# Altium project Jumperless_breadboard_REV1.PrjPcb (part 2 of 4)

## Sheet +-9V Supply.SchDoc
size 330 x 203 mm; SheetNumber: 12; SheetTotal: 14
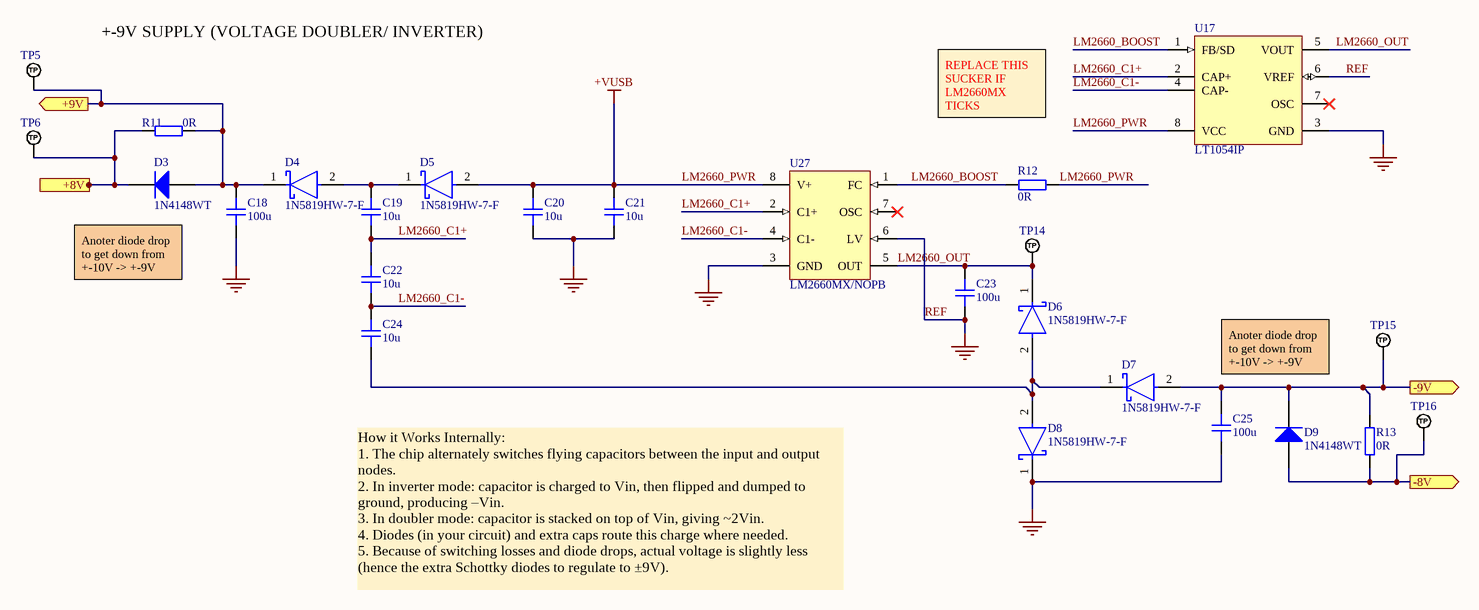
[diagram p9: +-9V Supply.SchDoc]

### Parts
C18  100u  [CAP_1210]
C19  10u  [CAP_1210]
C20  10u  [CAP_1210]
C21  10u  [CAP_1210]
C22  10u  [CAP_1210]
C23  100u  [CAP_1210]
C24  10u  [CAP_1210]
C25  100u  [CAP_1210]
D3  1N4148WT  [FAIR-SOD-523F-2_V]
D4  1N5819HW-7-F  [FP-SOD123-IPC_A]
D5  1N5819HW-7-F  [FP-SOD123-IPC_A]
D6  1N5819HW-7-F  [FP-SOD123-IPC_A]
D7  1N5819HW-7-F  [FP-SOD123-IPC_A]
D8  1N5819HW-7-F  [FP-SOD123-IPC_A]
D9  1N4148WT  [FAIR-SOD-523F-2_V]
R11  0R  [RES_0603]
R12  0R  [RES_0603]
R13  0R  [RES_0603]
TP5  TP_NOBOM  [PAD_RND_1MM]  (value not drawn)  (no BOM)
TP6  TP_NOBOM  [PAD_RND_1MM]  (value not drawn)  (no BOM)
TP14  TP_NOBOM  [PAD_RND_1MM]  (value not drawn)  (no BOM)
TP15  TP_NOBOM  [PAD_RND_1MM]  (value not drawn)  (no BOM)
TP16  TP_NOBOM  [PAD_RND_1MM]  (value not drawn)  (no BOM)
U17  LT1054IP  [P0008A]
U27  LM2660MX/NOPB  [D0008A_M]

### Ports
+8V (out), +9V (out), -8V (out), -9V (out)

### Nets
+8V: D3.1(K) R11.1 TP6.1(TP) ; port +8V
+VUSB: C20.2 C21.2 D5.2(A) R12.1 U17.8(VCC) U27.8(V+)  [also labelled LM2660_PWR]  [project net ANALOG_5V]
-8V: D9.2(A) R13.1 TP16.1(TP) ; port -8V
CH446_VDD: C18.2 D3.2(A) D4.1(C) R11.2 TP5.1(TP) ; port +9V
CH446_VEE: C25.2 D7.2(A) D9.1(K) R13.2 TP15.1(TP) ; port -9V
REF: C18.1 C20.1 C21.1 C23.1 C25.1 D8.1(C) U17.3(GND) U17.6(VREF) U27.3(GND) U27.6(LV)  [also labelled GND]
LM2660_BOOST: R12.2 U17.1(FB/SD) U27.1(FC)  [project net LM2660_BOOST_12]
LM2660_C1+: C19.1 C22.2 U17.2(CAP+) U27.2(C1+)  [project net LM2660_C1+_12]
LM2660_C1-: C22.1 C24.2 U17.4(CAP-) U27.4(C1-)  [project net LM2660_C1-_12]
LM2660_OUT: C23.2 D6.1(C) TP14.1(TP) U17.5(VOUT) U27.5(OUT)  [project net LM2660_OUT_12]
NetC19_2: C19.2 D4.2(A) D5.1(C)
NetC24_1: C24.1 D6.2(A) D7.1(C) D8.2(A)

Not connected (* = marked no-connect by the designer): U17 7(OSC)*; U27 7(OSC)*

### Notes on the sheet
- +-9V SUPPLY (VOLTAGE DOUBLER/ INVERTER)
- REPLACE THIS SUCKER IF LM2660MX TICKS
- Anoter diode drop to get down from +-10V -> +-9V
- How it Works Internally:
  1. The chip alternately switches flying capacitors between the input and output nodes.
  2. In inverter mode: capacitor is charged to Vin, then flipped and dumped to ground, producing –Vin.
  3. In doubler mode: capacitor is stacked on top of Vin, giving ~2Vin.
  4. Diodes (in your circuit) and extra caps route this charge where needed.
  5. Because of switching losses and diode drops, actual voltage is slightly less (hence the extra Schottky diodes to regulate to ±9V).

### Library data of the parts
C18-C25 = CAP_1210: Capacitor SMD 1210; Manufacturer: *; Manufacturer Part Number: *; Distributor Link: *; LCSC: *; Rating: *; Dielectric: *
D3 D9 = CMP-0881-00001-1: High Conductance Fast Switching Diode, 75 V, -55 to 150 degC, 2-Pin SOD523F, RoHS; Manufacturer: Fairchild Semiconductor; IR (VR: 75 V)=5 uA Max.; VF: 1 V Max.; BVR (IR: 5 uA)=75 V Min.; CO: 4 pF Max.; DatasheetVersion: Rev. A2; ComponentLink1Description: Manufacturer URL; PackageDescription: 2-Pin Surface Mount Device, Body 1.2 x 0.8 mm, Height 0.7 mm; ComponentLink2URL: http://www.fairchildsemi.com/ds/1N/1N4148WT.pdf; ComponentLink2Description: Datasheet; PartNumber: 1N4148WT; ComponentLink1URL: http://www.fairchildsemi.com/; Temperature Range: -55 to 150 degC; Mounting Technology: Surface Mount; PackageReference: SOD-523F-2; RoHS: TRUE
D4-D8 = CMP-0303-00003-3: DIODE SCHOTTKY 40V 1A SOD123; Forward Voltage: 450mV; Capacitance: 110pF; Max Forward Surge Current (Ifsm): 25A; Peak Reverse Current: 50uA; Polarity: Standard; Element Configuration: Single; Max Power Dissipation: 450mW; Min Operating Temperature: -65°C; Package Quantity: 3000; Contact Plating: Tin; Weight: 0.000353oz; Max Repetitive Reverse Voltage (Vrrm): 40V; Max Reverse Voltage (DC): 40V; Height: 1.25mm; Average Rectified Current: 1A; Width: 1.7mm; Case/Package: SOD-123-2; Lead Free: Lead Free; Max Operating Temperature: 125°C; Current Rating: 1A; Termination: SMD/SMT; Forward Current: 1A; Radiation Hardening: No; Number of Pins: 2; Length: 2.85mm; Voltage Rating (DC): 40V; REACH SVHC: No SVHC; Peak Non-Repetitive Surge Current: 25A; Packaging: Tape and Reel; Output Current: 1A
R11-R13 = RES_0603: Resistor SMD 0603; Manufacturer: *; Manufacturer Part Number: *; Distributor Link: *; LCSC: *
TP5 TP6 TP14-TP16 = TEST_POINT_RND_1MM: Test Point Round 1mm (NO BOM)
U17 = CMP-0391-00173-2: -5 V, Buck / Boost Charge Pump, 100 mA, 3.5 to 15 V Input, -40 to 85 degC, 8-pin DIP (P8), Pb-Free (RoHS); Manufacturer: Texas Instruments; Vin(Min)(V): 3.5; Vout(Max)(V): -5.2; Iout(Max)(A): 0.1; Iq(Typ)(mA): 2.5; Switching Frequency(Max)(kHz): 35; Vout(Min)(V): -4.7; Vin(Max)(V): 15; ComponentLink3URL: http://www.ti.com/litv/pdf/mpdi001b; Eco-Plan: Pb-Free (RoHS); PackageVersion: 4040082/E; DatasheetVersion: SLVS033F; Mounting Technology: Through Hole; ComponentLink1Description: Manufacturer URL; Preset Vout(V): -5; Topology: Buck/Boost; ComponentLink1URL: http://www.ti.com/; ComponentLink2Description: Datasheet; ComponentLink3Description: Package Specification; PartNumber: LT1054IP; PackageDescription: 8-Pin Plastic In-Line, Body 9.59 x 6.35 mm, 2.54 mm Pitch; ComponentLink2URL: http://www.ti.com/general/docs/lit/getliterature.tsp?genericPartNumber=LT1054&fileType=pdf; PackageReference: P0008A; Code_JEDEC: MS-001
U27 = CMP-0065-00023-3: Switched Capacitor Voltage Converter, 8-pin Narrow SOIC, Pb-Free; Manufacturer: Texas Instruments; CompType: Switch Caps; PowerWise: N; PackageTopMarking: NSZXTT*LM26*60M; PackageReference: D0008A; ComponentLink1Description: Datasheet URL; PinCount: 8; PackageDescription: SOIC Narrow, 4.9 x 3.9 x 1.45mm, 8 Lead, 1.27mm Pitch; RoHS: Y; Code_IPC: SOIC127P600-8; Code_JEDEC: MS-012-AA; ComponentLink1URL: http://www.ti.com/general/docs/lit/getliterature.tsp?genericPartNumber=LM2660&fileType=pdf

## Sheet BreadBoard.SchDoc
size 190 x 203 mm; SheetNumber: 7; SheetTotal: 15
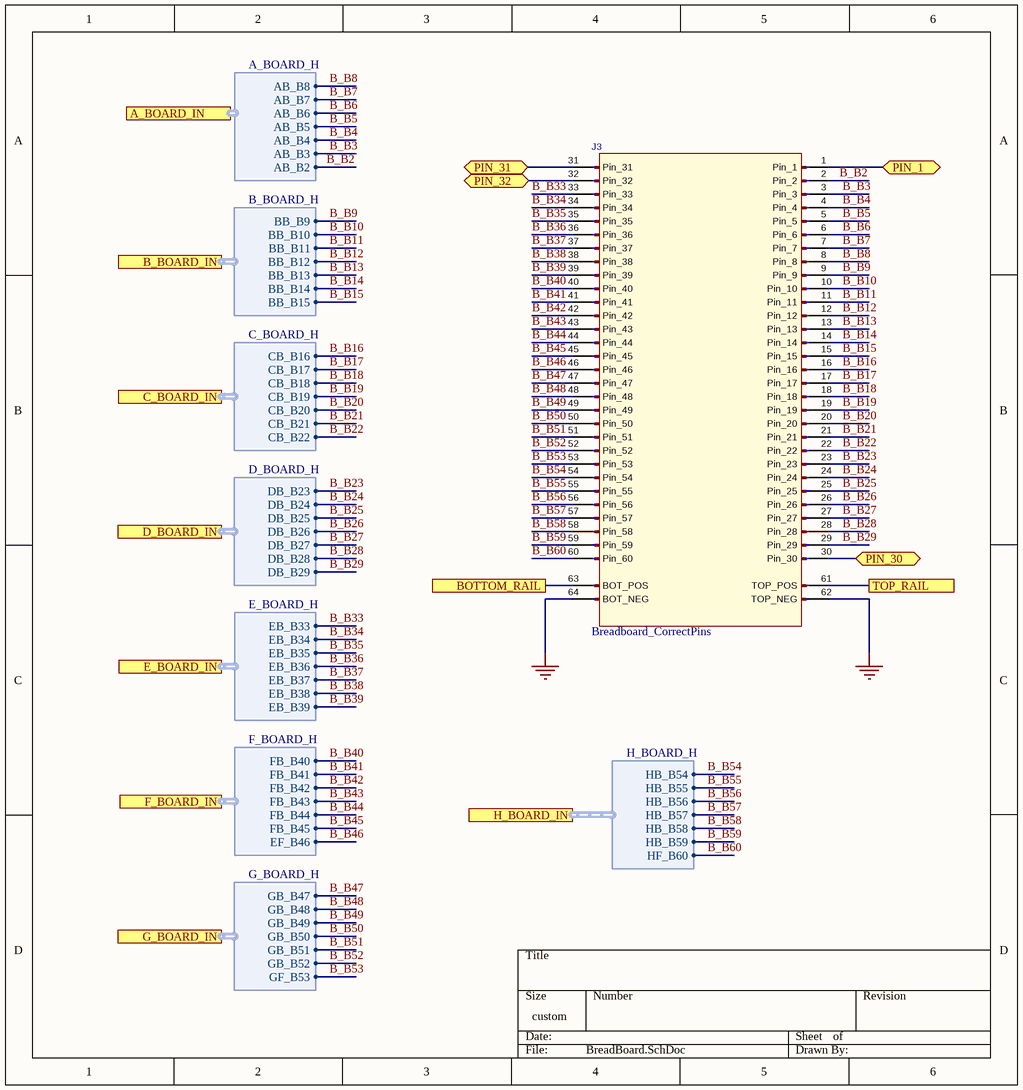
[diagram p10: BreadBoard.SchDoc]

### Parts
J3  Breadboard_CorrectPins  [Breadboard_CustomClips_CorrectPins_1]

### Ports
A_BOARD_IN (harness A_BOARD_H), B_BOARD_IN (harness B_BOARD_H), BOTTOM_RAIL, C_BOARD_IN (harness C_BOARD_H), D_BOARD_IN (harness D_BOARD_H), E_BOARD_IN (harness E_BOARD_H), F_BOARD_IN (harness F_BOARD_H), G_BOARD_IN (harness G_BOARD_H), H_BOARD_IN (harness H_BOARD_H), PIN_1 (bidir), PIN_30 (bidir), PIN_31 (bidir), PIN_32 (bidir), TOP_RAIL

### Harnesses
A_BOARD_H: AB_B2, AB_B3, AB_B4, AB_B5, AB_B6, AB_B7, AB_B8
B_BOARD_H: BB_B10, BB_B11, BB_B12, BB_B13, BB_B14, BB_B15, BB_B9
C_BOARD_H: CB_B16, CB_B17, CB_B18, CB_B19, CB_B20, CB_B21, CB_B22
D_BOARD_H: DB_B23, DB_B24, DB_B25, DB_B26, DB_B27, DB_B28, DB_B29
E_BOARD_H: EB_B33, EB_B34, EB_B35, EB_B36, EB_B37, EB_B38, EB_B39
F_BOARD_H: EF_B46, FB_B40, FB_B41, FB_B42, FB_B43, FB_B44, FB_B45
G_BOARD_H: GB_B47, GB_B48, GB_B49, GB_B50, GB_B51, GB_B52, GF_B53
H_BOARD_H: HB_B54, HB_B55, HB_B56, HB_B57, HB_B58, HB_B59, HF_B60

### Nets
GND: J3.62(TOP_NEG) J3.64(BOT_NEG)  [project net REF]
B_B2: J3.2(Pin_2) ; port A_BOARD_IN.AB_B2
B_B3: J3.3(Pin_3) ; port A_BOARD_IN.AB_B3
B_B4: J3.4(Pin_4) ; port A_BOARD_IN.AB_B4
B_B5: J3.5(Pin_5) ; port A_BOARD_IN.AB_B5
B_B6: J3.6(Pin_6) ; port A_BOARD_IN.AB_B6
B_B7: J3.7(Pin_7) ; port A_BOARD_IN.AB_B7
B_B8: J3.8(Pin_8) ; port A_BOARD_IN.AB_B8
B_B9: J3.9(Pin_9) ; port B_BOARD_IN.BB_B9
B_B10: J3.10(Pin_10) ; port B_BOARD_IN.BB_B10
B_B11: J3.11(Pin_11) ; port B_BOARD_IN.BB_B11
B_B12: J3.12(Pin_12) ; port B_BOARD_IN.BB_B12
B_B13: J3.13(Pin_13) ; port B_BOARD_IN.BB_B13
B_B14: J3.14(Pin_14) ; port B_BOARD_IN.BB_B14
B_B15: J3.15(Pin_15) ; port B_BOARD_IN.BB_B15
B_B16: J3.16(Pin_16) ; port C_BOARD_IN.CB_B16
B_B17: J3.17(Pin_17) ; port C_BOARD_IN.CB_B17
B_B18: J3.18(Pin_18) ; port C_BOARD_IN.CB_B18
B_B19: J3.19(Pin_19) ; port C_BOARD_IN.CB_B19
B_B20: J3.20(Pin_20) ; port C_BOARD_IN.CB_B20
B_B21: J3.21(Pin_21) ; port C_BOARD_IN.CB_B21
B_B22: J3.22(Pin_22) ; port C_BOARD_IN.CB_B22
B_B23: J3.23(Pin_23) ; port D_BOARD_IN.DB_B23
B_B24: J3.24(Pin_24) ; port D_BOARD_IN.DB_B24
B_B25: J3.25(Pin_25) ; port D_BOARD_IN.DB_B25
B_B26: J3.26(Pin_26) ; port D_BOARD_IN.DB_B26
B_B27: J3.27(Pin_27) ; port D_BOARD_IN.DB_B27
B_B28: J3.28(Pin_28) ; port D_BOARD_IN.DB_B28
B_B29: J3.29(Pin_29) ; port D_BOARD_IN.DB_B29
B_B33: J3.33(Pin_33) ; port E_BOARD_IN.EB_B33
B_B34: J3.34(Pin_34) ; port E_BOARD_IN.EB_B34
B_B35: J3.35(Pin_35) ; port E_BOARD_IN.EB_B35
B_B36: J3.36(Pin_36) ; port E_BOARD_IN.EB_B36
B_B37: J3.37(Pin_37) ; port E_BOARD_IN.EB_B37
B_B38: J3.38(Pin_38) ; port E_BOARD_IN.EB_B38
B_B39: J3.39(Pin_39) ; port E_BOARD_IN.EB_B39
B_B40: J3.40(Pin_40) ; port F_BOARD_IN.FB_B40
B_B41: J3.41(Pin_41) ; port F_BOARD_IN.FB_B41
B_B42: J3.42(Pin_42) ; port F_BOARD_IN.FB_B42
B_B43: J3.43(Pin_43) ; port F_BOARD_IN.FB_B43
B_B44: J3.44(Pin_44) ; port F_BOARD_IN.FB_B44
B_B45: J3.45(Pin_45) ; port F_BOARD_IN.FB_B45
B_B46: J3.46(Pin_46) ; port F_BOARD_IN.EF_B46
B_B47: J3.47(Pin_47) ; port G_BOARD_IN.GB_B47
B_B48: J3.48(Pin_48) ; port G_BOARD_IN.GB_B48
B_B49: J3.49(Pin_49) ; port G_BOARD_IN.GB_B49
B_B50: J3.50(Pin_50) ; port G_BOARD_IN.GB_B50
B_B51: J3.51(Pin_51) ; port G_BOARD_IN.GB_B51
B_B52: J3.52(Pin_52) ; port G_BOARD_IN.GB_B52
B_B53: J3.53(Pin_53) ; port G_BOARD_IN.GF_B53
B_B54: J3.54(Pin_54) ; port H_BOARD_IN.HB_B54
B_B55: J3.55(Pin_55) ; port H_BOARD_IN.HB_B55
B_B56: J3.56(Pin_56) ; port H_BOARD_IN.HB_B56
B_B57: J3.57(Pin_57) ; port H_BOARD_IN.HB_B57
B_B58: J3.58(Pin_58) ; port H_BOARD_IN.HB_B58
B_B59: J3.59(Pin_59) ; port H_BOARD_IN.HB_B59
B_B60: J3.60(Pin_60) ; port H_BOARD_IN.HF_B60
BB_1: J3.1(Pin_1) ; port PIN_1
BB_30: J3.30(Pin_30) ; port PIN_30
BB_31: J3.31(Pin_31) ; port PIN_31
BB_32: J3.32(Pin_32) ; port PIN_32
BB_BOTTOM_RAIL: J3.63(BOT_POS) ; port BOTTOM_RAIL
BB_TOP_RAIL: J3.61(TOP_POS) ; port TOP_RAIL

## Sheet ANALOG_CIRCUITS.SchDoc
size 482 x 304 mm; SheetNumber: 9; SheetTotal: 14
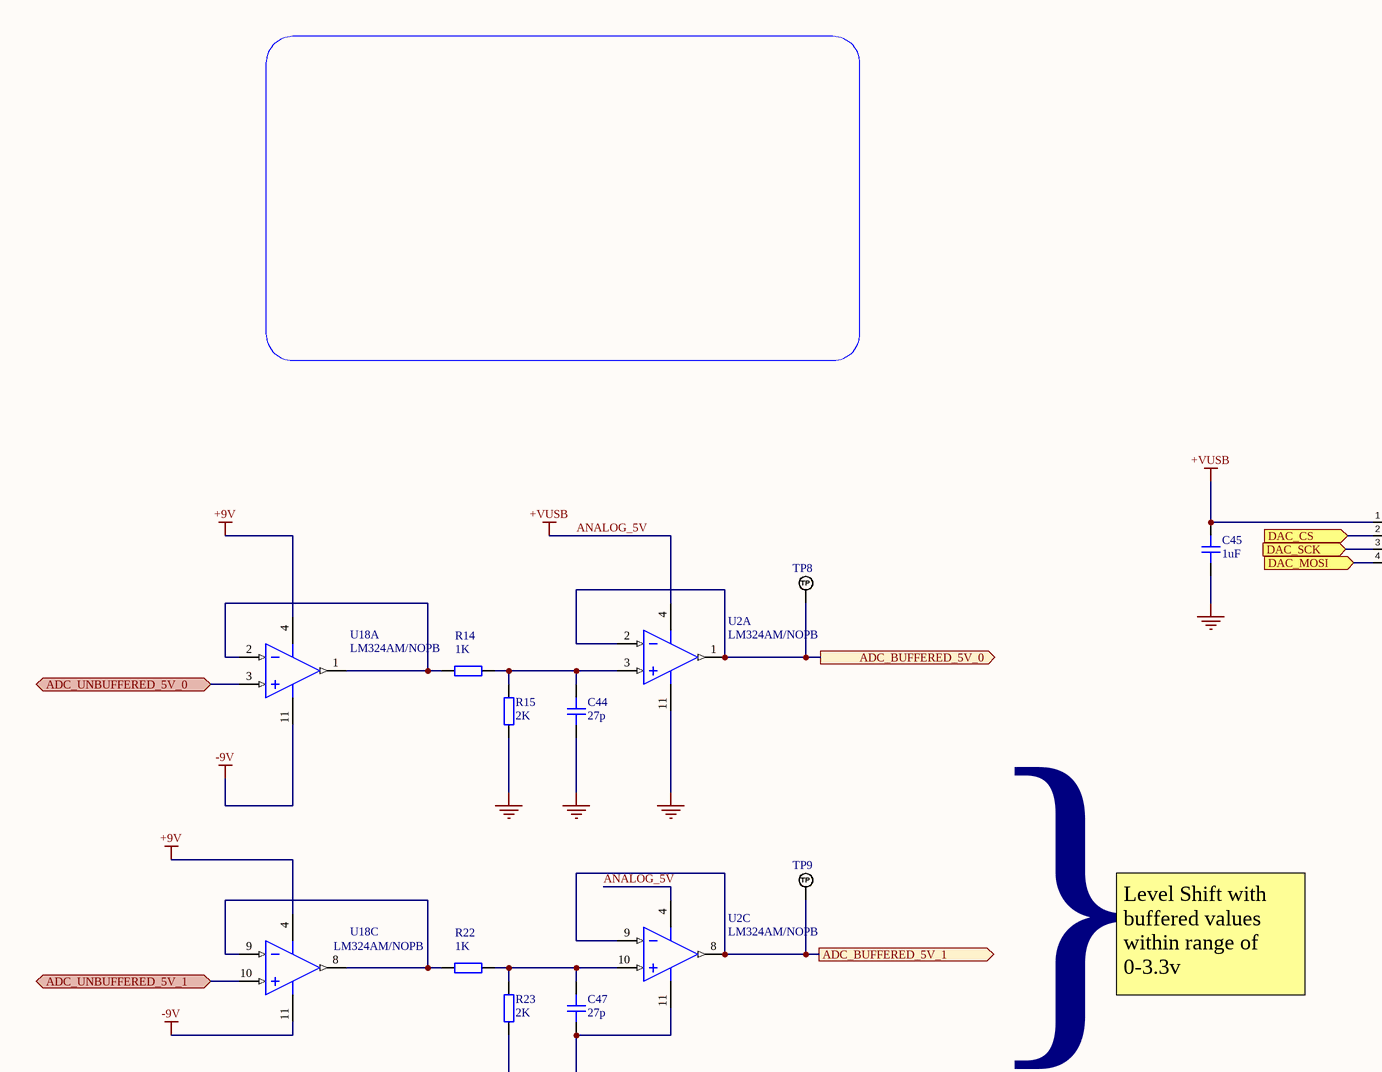
[diagram p11: ANALOG_CIRCUITS.SchDoc, top left]
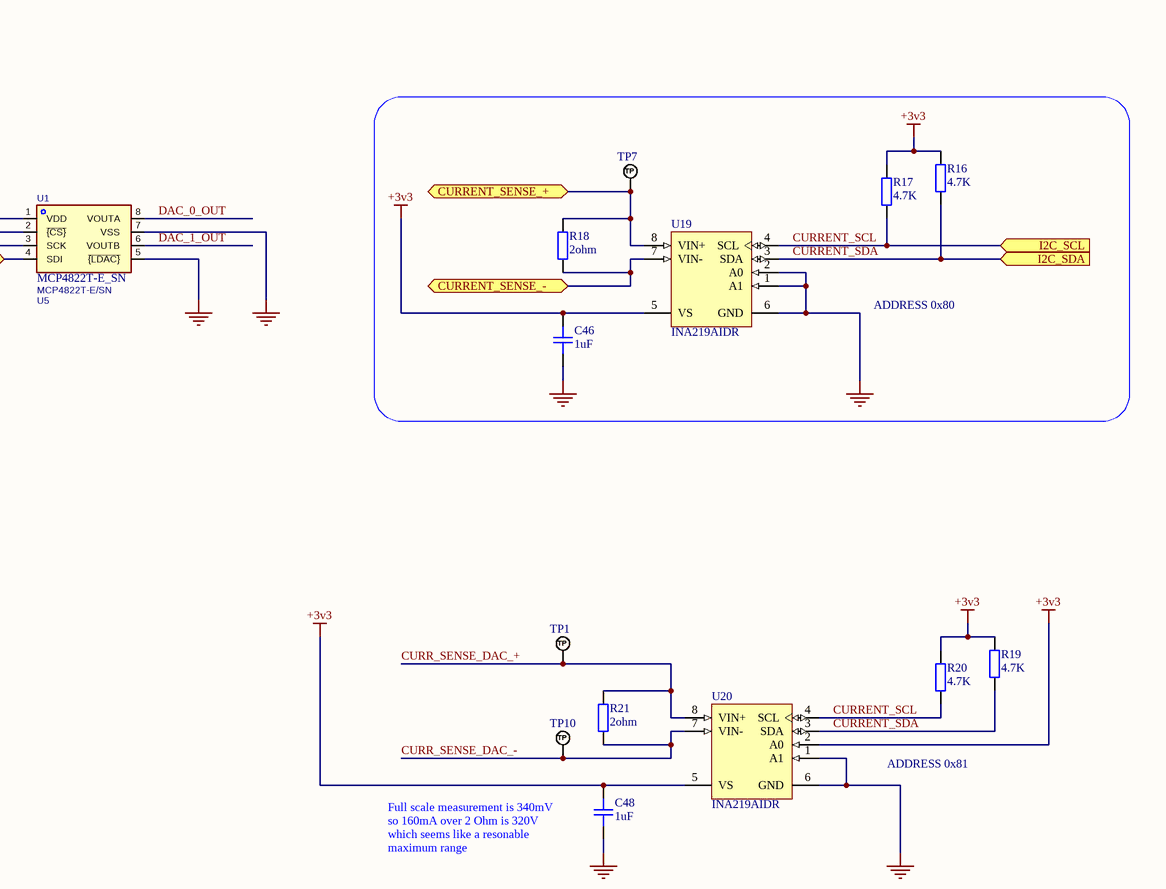
[diagram p12: ANALOG_CIRCUITS.SchDoc, top right]
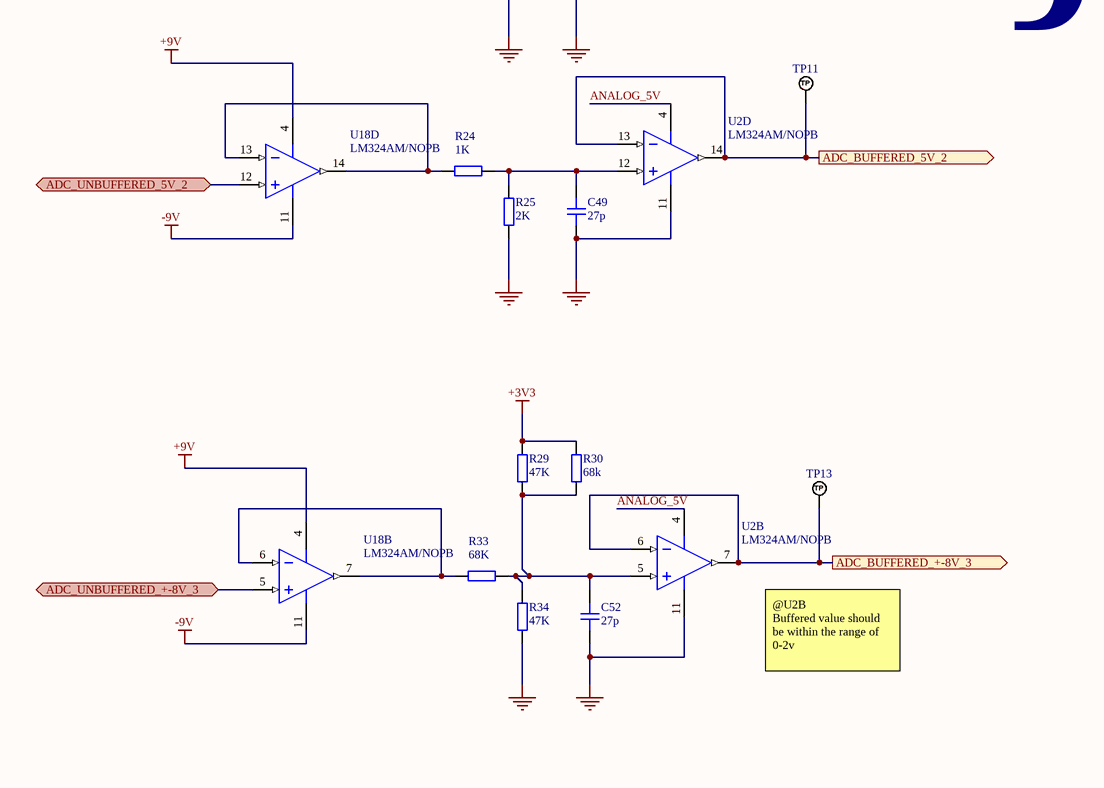
[diagram p13: ANALOG_CIRCUITS.SchDoc, bottom left]
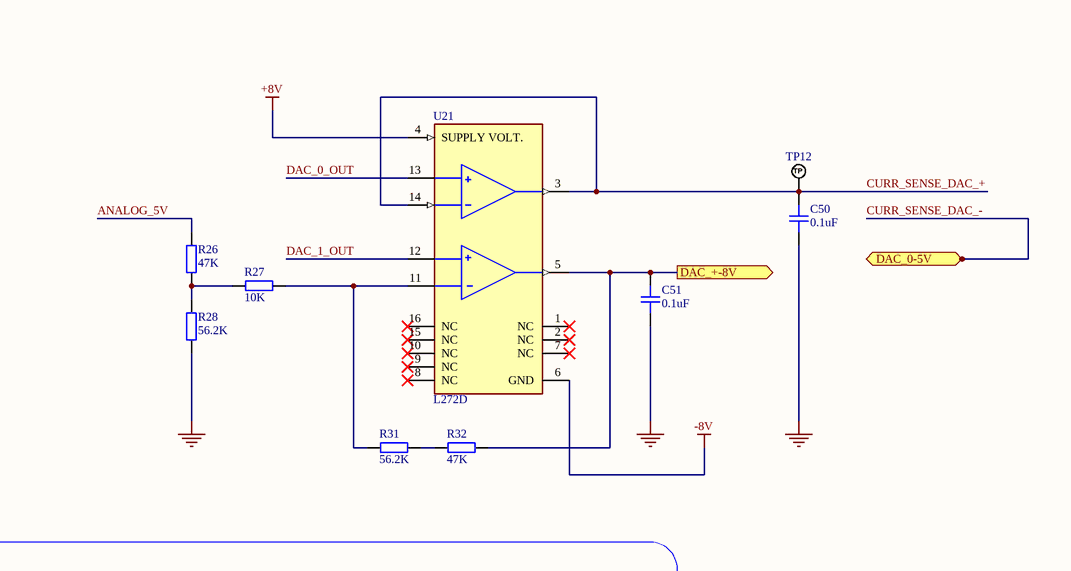
[diagram p14: ANALOG_CIRCUITS.SchDoc, bottom right]

### Parts
C44  27p  [CAP_0603]
C45  1uF  [CAP_0603]
C46  1uF  [CAP_0603]
C47  27p  [CAP_0603]
C48  1uF  [CAP_0603]
C49  27p  [CAP_0603]
C50  0.1uF  [CAP_0603]
C51  0.1uF  [CAP_0603]
C52  27p  [CAP_0603]
R14  1K  [RES_0603]
R15  2K  [RES_0603]
R16  4.7K  [RES_0603]
R17  4.7K  [RES_0603]
R18  2ohm  [RES_0603]
R19  4.7K  [RES_0603]
R20  4.7K  [RES_0603]
R21  2ohm  [RES_0603]
R22  1K  [RES_0603]
R23  2K  [RES_0603]
R24  1K  [RES_0603]
R25  2K  [RES_0603]
R26  47K  [RES_0603]
R27  10K  [RES_0603]
R28  56.2K  [RES_0603]
R29  47K  [RES_0603]
R30  68k  [RES_0603]
R31  56.2K  [RES_0603]
R32  47K  [RES_0603]
R33  68K  [RES_0603]
R34  47K  [RES_0603]
TP1  TP_NOBOM  [PAD_RND_1MM]  (value not drawn)  (no BOM)
TP7  TP_NOBOM  [PAD_RND_1MM]  (value not drawn)  (no BOM)
TP8  TP_NOBOM  [PAD_RND_1MM]  (value not drawn)  (no BOM)
TP9  TP_NOBOM  [PAD_RND_1MM]  (value not drawn)  (no BOM)
TP10  TP_NOBOM  [PAD_RND_1MM]  (value not drawn)  (no BOM)
TP11  TP_NOBOM  [PAD_RND_1MM]  (value not drawn)  (no BOM)
TP12  TP_NOBOM  [PAD_RND_1MM]  (value not drawn)  (no BOM)
TP13  TP_NOBOM  [PAD_RND_1MM]  (value not drawn)  (no BOM)
U1  MCP4822T-E_SN  value MCP4822T-E/SN  Reference: U5  [SOIC-8_L4.9-W3.9-P1.27-LS6.0-BL]
U2  LM324AM/NOPB  [D0014A_M]  (parts A,B,C,D of 4)
U18  LM324AM/NOPB  [D0014A_M]  (parts A,B,C,D of 4)
U19  INA219AIDR  [D0008A_L]
U20  INA219AIDR  [D0008A_L]
U21  L272D  [FP-SO16_Narrow-0016020-IPC_C]

### Blocks framed on the sheet
ADDRESS 0x80: C46 R16-R18 TP7 U19

### Ports
ADC_BUFFERED_5V_0 (out), ADC_BUFFERED_5V_1 (out), ADC_BUFFERED_5V_2 (out), ADC_BUFFERED_+-8V_3 (out), ADC_UNBUFFERED_5V_0 (bidir), ADC_UNBUFFERED_5V_1 (bidir), ADC_UNBUFFERED_5V_2 (bidir), ADC_UNBUFFERED_+-8V_3 (bidir), CURRENT_SENSE_+ (bidir), CURRENT_SENSE_- (bidir), DAC_0-5V (bidir), DAC_+-8V (out), DAC_CS (in), DAC_MOSI (in), DAC_SCK (in), I2C_SCL (in), I2C_SDA (in)

### Nets
+3V3: C46.2 C48.2 R16.2 R17.2 R19.2 R20.2 R29.2 R30.2 U19.5(VS) U20.2(A0) U20.5(VS)  [project net BUCK1_3v3]
+8V: U21.4(SUPPLY_VOLT.)
+9V: U18.4(V+)  [project net CH446_VDD]
-8V: U21.6(GND)
-9V: U18.11(GND)  [project net CH446_VEE]
ANALOG_5V: C45.2 R26.2 U1.1(VDD) U2.4(V+)  [also labelled +VUSB]
GND: C44.1 C45.1 C46.1 C47.1 C48.1 C49.1 C50.1 C51.1 C52.1 R15.1 R23.1 R25.1 R28.1 R34.1 U1.5(~{{LDAC}}) U1.7(VSS) U2.11(GND) U19.1(A1) U19.2(A0) U19.6(GND) U20.1(A1) U20.6(GND)  [project net REF]
ADC_BUFF_5V_0: TP8.1(TP) U2.1(OUT1) U2.2(IN1-) ; port ADC_BUFFERED_5V_0
ADC_BUFF_5V_1: TP9.1(TP) U2.8(OUT3) U2.9(IN3-) ; port ADC_BUFFERED_5V_1
ADC_BUFF_5V_2: TP11.1(TP) U2.13(IN4-) U2.14(OUT4) ; port ADC_BUFFERED_5V_2
ADC_BUFF_+-8V: TP13.1(TP) U2.6(IN2-) U2.7(OUT2) ; port ADC_BUFFERED_+-8V_3
CURR_SENSE_DAC_+: C50.2 R21.2 TP1.1(TP) TP12.1(TP) U20.8(VIN+) U21.3(OUTPUT_1) U21.14(INPUT-_1)  [project net CURR_SENSE_DAC_+_9]
CURRENT_SCL: R17.1 R20.1 U19.4(SCL) U20.4(SCL) ; port I2C_SCL
CURRENT_SDA: R16.1 R19.1 U19.3(SDA) U20.3(SDA) ; port I2C_SDA
DAC-SS: U1.2(~{{CS}}) ; port DAC_CS
DAC_0_OUT: U1.8(VOUTA) U21.13(INPUT+_1)  [project net DAC_0_OUT_9]
DAC_1_OUT: U1.6(VOUTB) U21.12(INPUT+_2)  [project net DAC_1_OUT_9]
DAC_CLOCK: U1.3(SCK) ; port DAC_SCK
DAC_DATA: U1.4(SDI) ; port DAC_MOSI
NetC44_2: C44.2 R14.2 R15.2 U2.3(IN1+)
NetC47_2: C47.2 R22.2 R23.2 U2.10(IN3+)
NetC49_2: C49.2 R24.2 R25.2 U2.12(IN4+)
NetC51_2: C51.2 R32.1 U21.5(OUTPUT_2) ; port DAC_+-8V
NetC52_2: C52.2 R29.1 R30.1 R33.2 R34.2 U2.5(IN2+)
NetR14_1: R14.1 U18.1(OUT1) U18.2(IN1-)
NetR18_1: R18.1 U19.7(VIN-) ; port CURRENT_SENSE_-
NetR18_2: R18.2 TP7.1(TP) U19.8(VIN+) ; port CURRENT_SENSE_+
NetR21_1: R21.1 TP10.1(TP) U20.7(VIN-)
NetR22_1: R22.1 U18.8(OUT3) U18.9(IN3-)
NetR24_1: R24.1 U18.13(IN4-) U18.14(OUT4)
NetR26_1: R26.1 R27.2 R28.2
NetR27_1: R27.1 R31.2 U21.11(INPUT-_2)
NetR31_1: R31.1 R32.2
NetR33_1: R33.1 U18.6(IN2-) U18.7(OUT2)
NetU18_3: U18.3(IN1+) ; port ADC_UNBUFFERED_5V_0
NetU18_5: U18.5(IN2+) ; port ADC_UNBUFFERED_+-8V_3
NetU18_10: U18.10(IN3+) ; port ADC_UNBUFFERED_5V_1
NetU18_12: U18.12(IN4+) ; port ADC_UNBUFFERED_5V_2

Not connected (* = marked no-connect by the designer): U21 1(NC)* 2(NC)* 7(NC)* 8(NC)* 9(NC)* 10(NC)* 15(NC)* 16(NC)*

### Notes on the sheet
- Level Shift with buffered values within range of 0-3.3v
- ADDRESS 0x81
- }
- Full scale measurement is 340mV
  so 160mA over 2 Ohm is 320V
  which seems like a resonable maximum range
- @U2B
  Buffered value should be within the range of 0-2v

### Library data of the parts
C44-C52 = CAP_0603: Capacitor SMD 0603; Manufacturer: *; Manufacturer Part Number: *; Distributor Link: *; LCSC: *; Rating: *; Dielectric: *
R14-R34 = RES_0603: Resistor SMD 0603; Manufacturer: *; Manufacturer Part Number: *; Distributor Link: *; LCSC: *
TP1 TP7-TP13 = TEST_POINT_RND_1MM: Test Point Round 1mm (NO BOM)
U2 U18 = CMP-0055-00733-3: Low Power Quad Operational Amplifier, 14-pin Narrow SOIC, Pb-Free; Manufacturer: Texas Instruments; PowerWise: N; PackageTopMarking: NSUZXYTTE#*LM324AM; CompType: Amplifiers; RoHS: Y; Code_IPC: SOIC127P600-14; ComponentLink1Description: Datasheet URL; PackageDescription: Molded Package S.O., .150in Wide, 14 Lead; PinCount: 14; Package Reference: D0014A; ComponentLink1URL: http://www.ti.com/general/docs/lit/getliterature.tsp?genericPartNumber=LM324-N&fileType=pdf; Code_JEDEC: MS-012AB
U19 U20 = CMP-0704-00003-2: Zero-Drift, Bi-Directional Current / Power Monitor, 3 to 5.5 V, -40 to 125 degC, 8-pin SOIC (D8), Green (RoHS & no Sb/Br); Manufacturer: Texas Instruments; Common Mode Range(Min)(V): 0; SubFamily: Current Shunt Monitor; Rating: Catalog; Input Offset (+/-)(Max)(uV): 100; Vs(Max)(V): 5.5; Common Mode Range(Max)(V): 26; Quiescent Current (+/-)(Typ)(mA): 0.7; Vs(Min)(V): 3; Gain(V/V): 1, 0.5, 0.25, 0.125; Small-Signal Bandwidth(Typ)(MHz): 0.011; PackageReference: D0008A; ComponentLink1URL: http://www.ti.com/; Eco-Plan: Green (RoHS & no Sb/Br); ComponentLink2URL: http://www.ti.com/general/docs/lit/getliterature.tsp?genericPartNumber=INA219&fileType=pdf; ComponentLink1Description: Manufacturer URL; ComponentLink3Description: Package Specification; Mounting Technology: Surface Mount; PackageDescription: 8-Pin Plastic Small Outline, Body 4.9 x 3.9 mm, Pitch 1.27 mm; ComponentLink3URL: http://www.ti.com/lit/ml/msoi002j/msoi002j.pdf; DatasheetVersion: SBOS448F; PackageVersion: 4040047-3/M, 06/2011; PartNumber: INA219AIDR; Code_JEDEC: MS-012; ComponentLink2Description: Datasheet; CMRR(Min)(dB): 100
U21 = CMP-12131-000001-1: IC OPAMP GP 2 CIRCUIT 16SO; Manufacturer: STMicroelectronics; Min Dual Supply Voltage: 2V; Number Of Channels: 2; Max Supply Voltage: 28V; Max Dual Supply Voltage: 14V; Voltage Gain: 50-70dB; Max Junction Temp: +150°C; Standoff Height: 0.1mm; Nominal Supply Current: 7.5-8mA; Gain Bandwidth: 350kHz; Input Bias Current: 0.3uA; Output Current Per Channel: 1A; Input Offset Voltage: 15mV; Min Supply Voltage: 4V; Ipc Land Pattern Name: SOIC127P600X175-16; Height: 1.75mm; ComponentLink2URL: https://www.st.com/resource/en/datasheet/l272.pdf; Device Class L3: Amplifiers - Op Amps; RoHS: TRUE; Package: SO16 Narrow-0016020; Octopart: https://octopart.com/l272d-stmicroelectronics-410409; ComponentLink2Description: Datasheet; Automotive: No; Category: IC; Device Class L1: Integrated Circuits (ICs); Temperature Range High: +85°C; Temperature Range Low: -40°C; Mouser Description: Operational Amplifier, Dual, 250 Khz, 2, 1 V/ S, 4V To 28V, Soic, 16 Rohs Compliant: Yes; Digikey Description: IC OPAMP GP 2 CIRCUIT 16SO; Device Class L2: Linear ICs; Temperature: -40°C to +85°C; Manufacturer Part Number: L272D; Lead Free: Yes
U1 = MCP4822T-E_SN: Footprint: easyeda2kicad:SOIC-8_L4.9-W3.9-P1.27-LS6.0-BL; LCSC Part: C623653

## Sheet CONTROL_ROUTING_CROSSPOINTS.SchDoc
size 381 x 304 mm; SheetNumber: 4; SheetTotal: 14
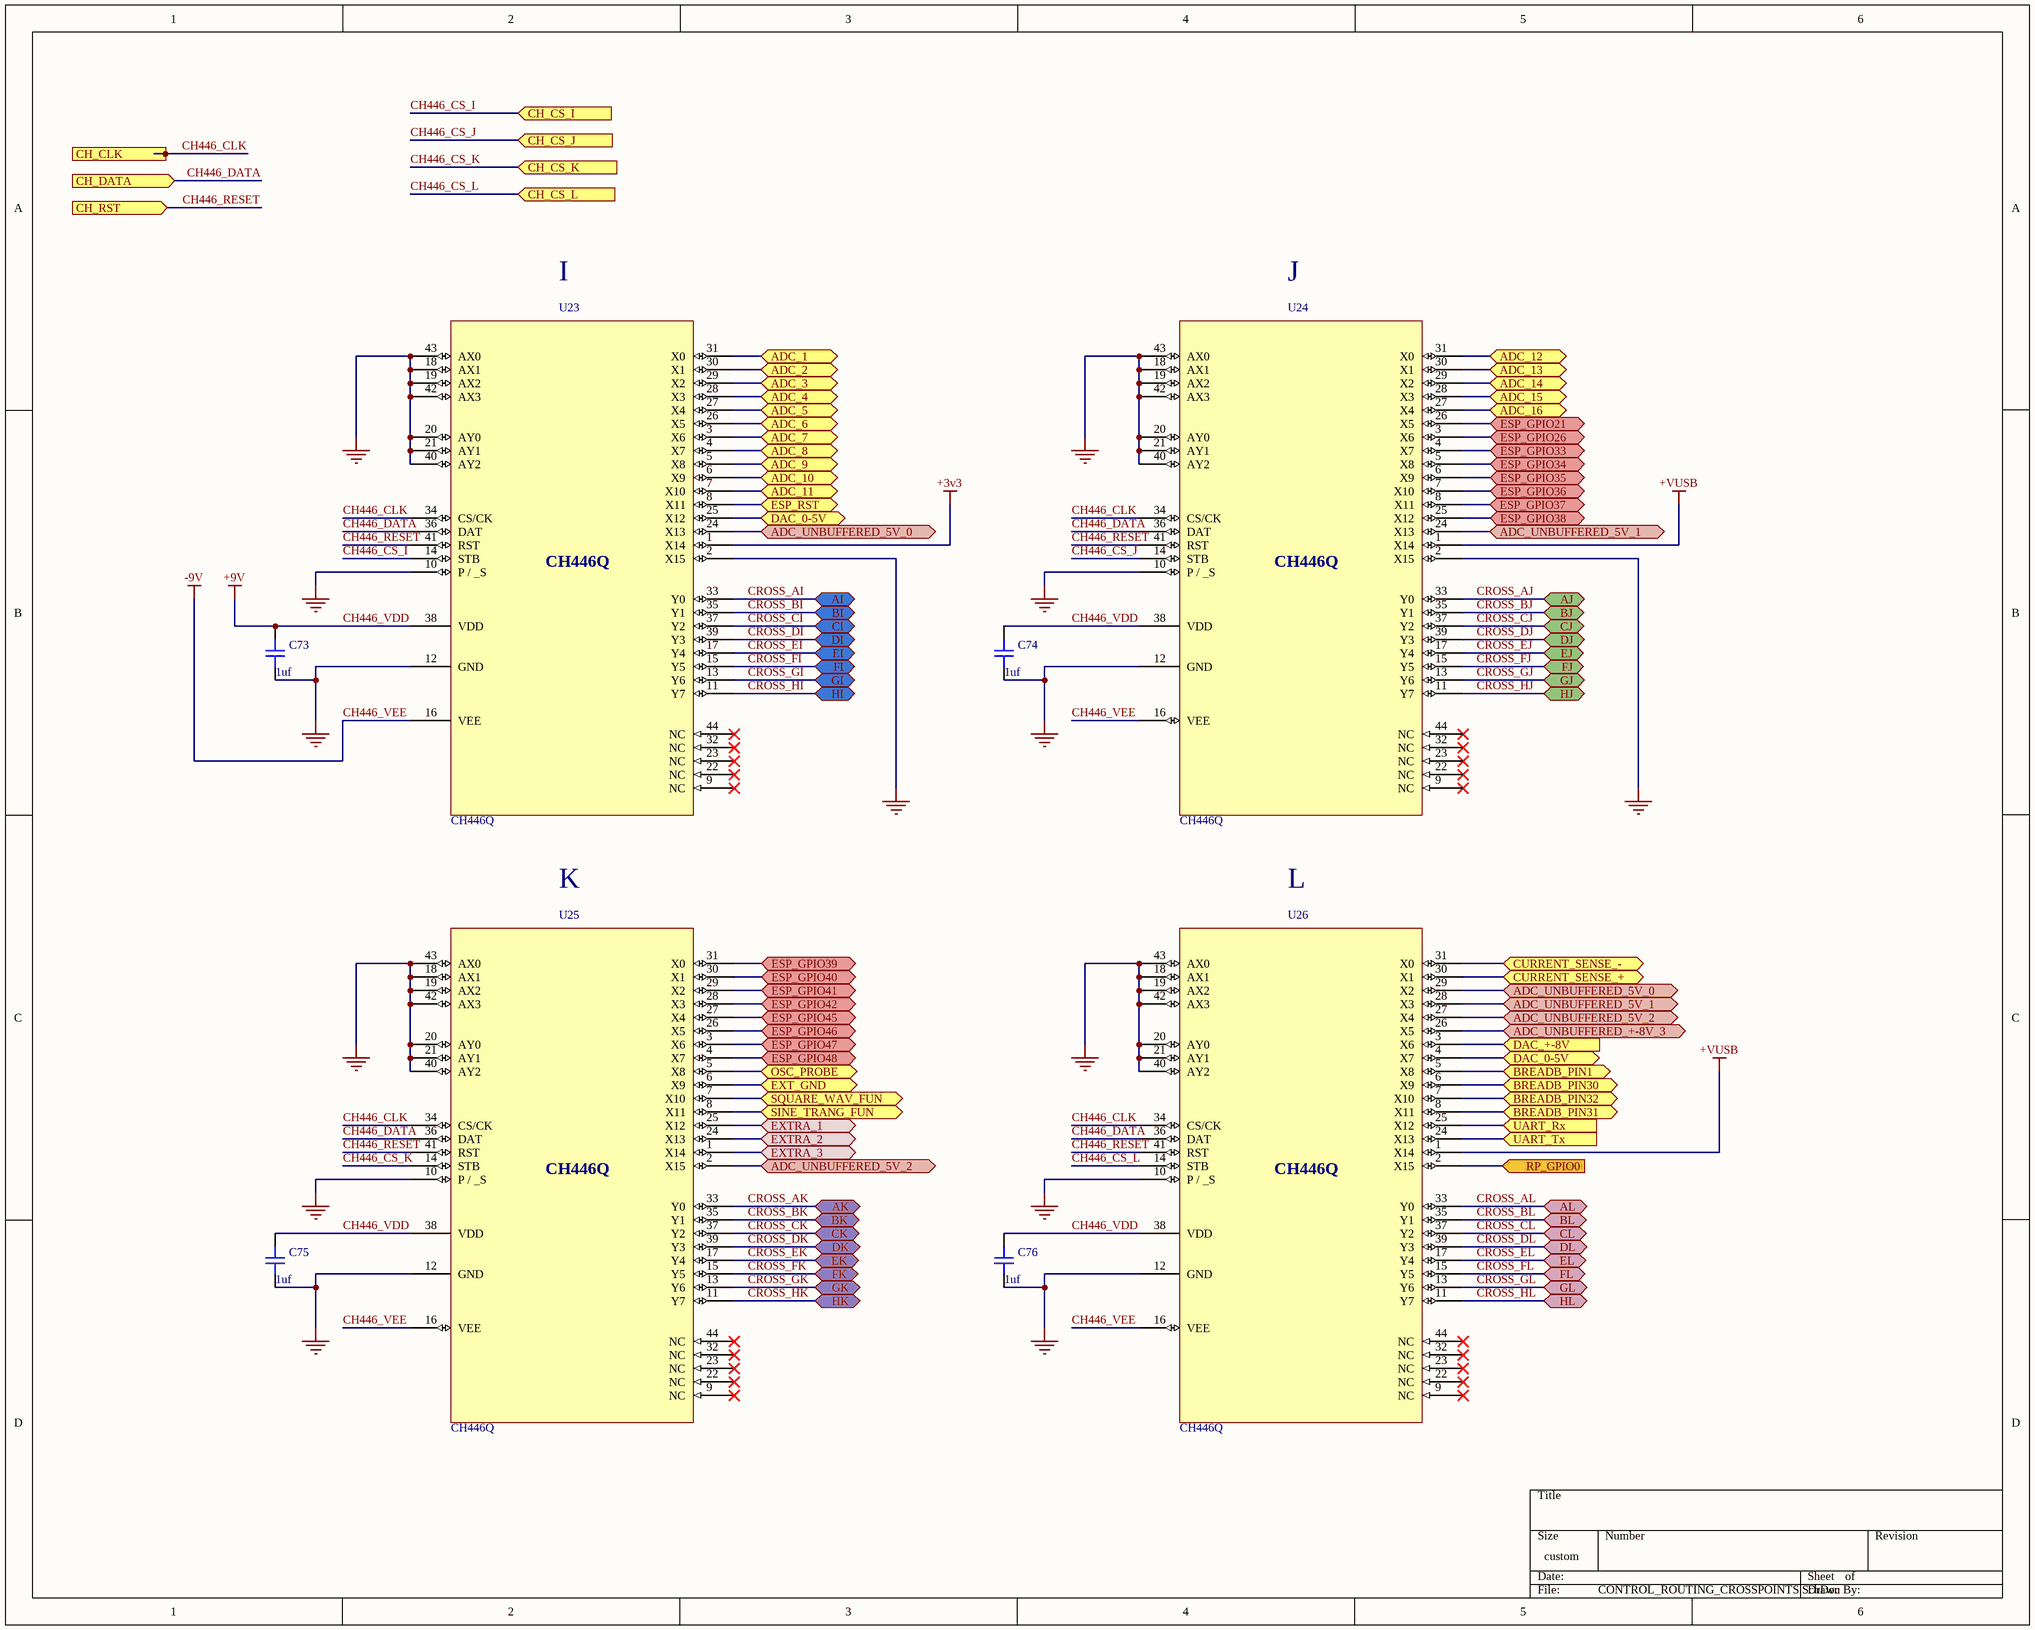
[diagram p15: CONTROL_ROUTING_CROSSPOINTS.SchDoc]

### Parts
C73  1uf  [CAP_0603]
C74  1uf  [CAP_0603]
C75  1uf  [CAP_0603]
C76  1uf  [CAP_0603]
U23  CH446Q  [PG-LQFP-44]
U24  CH446Q  [PG-LQFP-44]
U25  CH446Q  [PG-LQFP-44]
U26  CH446Q  [PG-LQFP-44]

### Ports
ADC_1 (bidir), ADC_2 (bidir), ADC_3 (bidir), ADC_4 (bidir), ADC_5 (bidir), ADC_6 (bidir), ADC_7 (bidir), ADC_8 (bidir), ADC_9 (bidir), ADC_10 (bidir), ADC_11 (bidir), ADC_12 (bidir), ADC_13 (bidir), ADC_14 (bidir), ADC_15 (bidir), ADC_16 (bidir), ADC_UNBUFFERED_5V_0 (bidir), ADC_UNBUFFERED_5V_1 (bidir), ADC_UNBUFFERED_5V_2 (bidir), ADC_UNBUFFERED_+-8V_3 (bidir), AI (bidir), AJ (bidir), AK (bidir), AL (bidir), BI (bidir), BJ (bidir), BK (bidir), BL (bidir), BREADB_PIN1 (bidir), BREADB_PIN30 (bidir), BREADB_PIN31 (bidir), BREADB_PIN32 (bidir), CH_CLK (in), CH_CS_I (in), CH_CS_J (in), CH_CS_K (in), CH_CS_L (in), CH_DATA (in), CH_RST (in), CI (bidir), CJ (bidir), CK (bidir), CL (bidir), CURRENT_SENSE_+ (bidir), CURRENT_SENSE_- (bidir), DAC_0-5V (bidir), DAC_+-8V (in), DI (bidir), DJ (bidir), DK (bidir), DL (bidir), EI (bidir), EJ (bidir), EK (bidir), EL (bidir), ESP_GPIO21 (bidir), ESP_GPIO26 (bidir), ESP_GPIO33 (bidir), ESP_GPIO34 (bidir), ESP_GPIO35 (bidir), ESP_GPIO36 (bidir), ESP_GPIO37 (bidir), ESP_GPIO38 (bidir), ESP_GPIO39 (bidir), ESP_GPIO40 (bidir), ESP_GPIO41 (bidir), ESP_GPIO42 (bidir), ESP_GPIO45 (bidir), ESP_GPIO46 (bidir), ESP_GPIO47 (bidir), ESP_GPIO48 (bidir), ESP_RST (bidir), EXT_GND (bidir), EXTRA_1 (bidir), EXTRA_2 (bidir), EXTRA_3 (bidir), FI (bidir), FJ (bidir), FK (bidir), FL (bidir), GI (bidir), GJ (bidir), GK (bidir), GL (bidir), HI (bidir), HJ (bidir), HK (bidir), HL (bidir), OSC_PROBE (bidir), RP_GPIO0 (in), SINE_TRANG_FUN (bidir), SQUARE_WAV_FUN (bidir), UART_Rx (in), UART_Tx (in)

### Nets
+3v3: U23.1(X14)  [project net BUCK1_3v3]
+VUSB: U24.1(X14) U26.1(X14)  [project net ANALOG_5V]
CH446_VDD: C73.2 C74.2 C75.2 C76.2 U23.38(VDD) U24.38(VDD) U25.38(VDD) U26.38(VDD)  [also labelled +9V]
CH446_VEE: U23.16(VEE) U24.16(VEE) U25.16(VEE) U26.16(VEE)  [also labelled -9V]
GND: C73.1 C74.1 C75.1 C76.1 U23.2(X15) U23.10(P_/__S) U23.12(GND) U23.18(AX1) U23.19(AX2) U23.20(AY0) U23.21(AY1) U23.40(AY2) U23.42(AX3) U23.43(AX0) U24.2(X15) U24.10(P_/__S) U24.12(GND) U24.18(AX1) U24.19(AX2) U24.20(AY0) U24.21(AY1) U24.40(AY2) U24.42(AX3) U24.43(AX0) U25.10(P_/__S) U25.12(GND) U25.18(AX1) U25.19(AX2) U25.20(AY0) U25.21(AY1) U25.40(AY2) U25.42(AX3) U25.43(AX0) U26.10(P_/__S) U26.12(GND) U26.18(AX1) U26.19(AX2) U26.20(AY0) U26.21(AY1) U26.40(AY2) U26.42(AX3) U26.43(AX0)  [project net REF]
\: U24.25(X12) ; port ESP_GPIO38
A0: U23.31(X0) ; port ADC_1
A1: U24.30(X1) ; port ADC_13
A2: U23.29(X2) ; port ADC_3
A3: U24.28(X3) ; port ADC_15
A4: U23.27(X4) ; port ADC_5
A5: U24.26(X5) ; port ESP_GPIO21
A6: U23.3(X6) ; port ADC_7
A7: U24.4(X7) ; port ESP_GPIO33
AREF: U24.8(X11) ; port ESP_GPIO37
BB_1: U26.5(X8) ; port BREADB_PIN1
BB_30: U26.6(X9) ; port BREADB_PIN30
BB_31: U26.8(X11) ; port BREADB_PIN31
BB_32: U26.7(X10) ; port BREADB_PIN32
CH446_CLK: U23.34(CS/CK) U24.34(CS/CK) U25.34(CS/CK) U26.34(CS/CK) ; port CH_CLK
CH446_CS_I: U23.14(STB) ; port CH_CS_I
CH446_CS_J: U24.14(STB) ; port CH_CS_J
CH446_CS_K: U25.14(STB) ; port CH_CS_K
CH446_CS_L: U26.14(STB) ; port CH_CS_L
CH446_DATA: U23.36(DAT) U24.36(DAT) U25.36(DAT) U26.36(DAT) ; port CH_DATA
CH446_RESET: U23.41(RST) U24.41(RST) U25.41(RST) U26.41(RST) ; port CH_RST
CROSS_AI: U23.33(Y0) ; port AI
CROSS_AJ: U24.33(Y0) ; port AJ
CROSS_AK: U25.33(Y0) ; port AK
CROSS_AL: U26.33(Y0) ; port AL
CROSS_BI: U23.35(Y1) ; port BI
CROSS_BJ: U24.35(Y1) ; port BJ
CROSS_BK: U25.35(Y1) ; port BK
CROSS_BL: U26.35(Y1) ; port BL
CROSS_CI: U23.37(Y2) ; port CI
CROSS_CJ: U24.37(Y2) ; port CJ
CROSS_CK: U25.37(Y2) ; port CK
CROSS_CL: U26.37(Y2) ; port CL
CROSS_DI: U23.39(Y3) ; port DI
CROSS_DJ: U24.39(Y3) ; port DJ
CROSS_DK: U25.39(Y3) ; port DK
CROSS_DL: U26.39(Y3) ; port DL
CROSS_EI: U23.17(Y4) ; port EI
CROSS_EJ: U24.17(Y4) ; port EJ
CROSS_EK: U25.17(Y4) ; port EK
CROSS_EL: U26.17(Y4) ; port EL
CROSS_FI: U23.15(Y5) ; port FI
CROSS_FJ: U24.15(Y5) ; port FJ
CROSS_FK: U25.15(Y5) ; port FK
CROSS_FL: U26.15(Y5) ; port FL
CROSS_GI: U23.13(Y6) ; port GI
CROSS_GJ: U24.13(Y6) ; port GJ
CROSS_GK: U25.13(Y6) ; port GK
CROSS_GL: U26.13(Y6) ; port GL
CROSS_HI: U23.11(Y7) ; port HI
CROSS_HJ: U24.11(Y7) ; port HJ
CROSS_HK: U25.11(Y7) ; port HK
CROSS_HL: U26.11(Y7) ; port HL
CROSS_Rx: U26.25(X12) ; port UART_Rx
CROSS_Tx: U26.24(X13) ; port UART_Tx
CURR_SENSE_DAC_-: U23.25(X12) U26.4(X7) ; port DAC_0-5V
D0: U24.31(X0) ; port ADC_12
D1: U23.30(X1) ; port ADC_2
D2: U24.29(X2) ; port ADC_14
D3: U23.28(X3) ; port ADC_4
D4: U24.27(X4) ; port ADC_16
D5: U23.26(X5) ; port ADC_6
D6: U24.3(X6) ; port ESP_GPIO26
D7: U23.4(X7) ; port ADC_8
D8: U24.5(X8) ; port ESP_GPIO34
D9: U23.6(X9) ; port ADC_10
D10: U24.6(X9) ; port ESP_GPIO35
D11: U23.5(X8) ; port ADC_9
D12: U24.7(X10) ; port ESP_GPIO36
D13: U23.7(X10) ; port ADC_11
DEV_BOOT: U25.3(X6) ; port ESP_GPIO47
DEV_RESET: U25.4(X7) ; port ESP_GPIO48
ESP_RESET: U23.8(X11) ; port ESP_RST
EX_GND: U25.6(X9) ; port EXT_GND
EXT_1: U25.25(X12) ; port EXTRA_1
EXT_2: U25.24(X13) ; port EXTRA_2
EXT_3: U25.1(X14) ; port EXTRA_3
GPIO0_RP: U26.2(X15) ; port RP_GPIO0
GPIO39: U25.31(X0) ; port ESP_GPIO39
GPIO40: U25.30(X1) ; port ESP_GPIO40
GPIO41: U25.29(X2) ; port ESP_GPIO41
GPIO42: U25.28(X3) ; port ESP_GPIO42
GPIO45: U25.27(X4) ; port ESP_GPIO45
GPIO46: U25.26(X5) ; port ESP_GPIO46
OSC_PROBE: U25.5(X8) ; port OSC_PROBE
SINE_TRANG_WAV: U25.8(X11) ; port SINE_TRANG_FUN
SQUARE_WAV: U25.7(X10) ; port SQUARE_WAV_FUN
NetC51_2: U26.3(X6) ; port DAC_+-8V
NetR18_1: U26.31(X0) ; port CURRENT_SENSE_-
NetR18_2: U26.30(X1) ; port CURRENT_SENSE_+
NetU18_3: U23.24(X13) U26.29(X2) ; port ADC_UNBUFFERED_5V_0
NetU18_5: U26.26(X5) ; port ADC_UNBUFFERED_+-8V_3
NetU18_10: U24.24(X13) U26.28(X3) ; port ADC_UNBUFFERED_5V_1
NetU18_12: U25.2(X15) U26.27(X4) ; port ADC_UNBUFFERED_5V_2

Not connected (* = marked no-connect by the designer): U23 9(NC)* 22(NC)* 23(NC)* 32(NC)* 44(NC)*; U24 9(NC)* 22(NC)* 23(NC)* 32(NC)* 44(NC)*; U25 9(NC)* 22(NC)* 23(NC)* 32(NC)* 44(NC)*; U26 9(NC)* 22(NC)* 23(NC)* 32(NC)* 44(NC)*

### Notes on the sheet
- I
- J
- K
- L

### Library data of the parts
C73-C76 = CAP_0603: Capacitor SMD 0603; Manufacturer: *; Manufacturer Part Number: *; Distributor Link: *; LCSC: *; Rating: *; Dielectric: *